# Altium schematic sheet GPS POWER.SchDoc
size A4
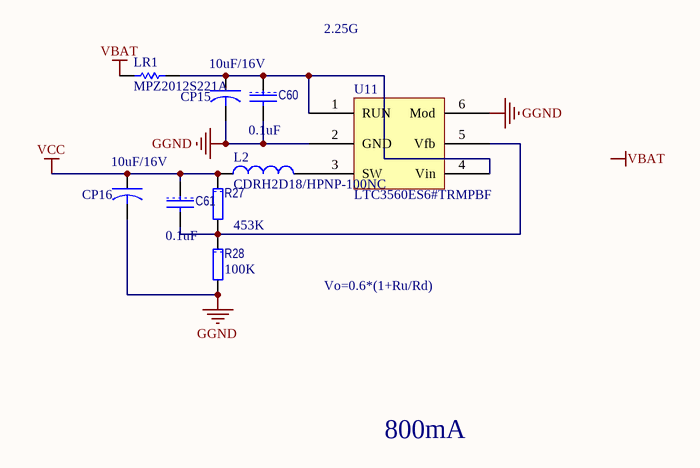
[diagram p0: GPS POWER.SchDoc]

## Parts
C60  value 0.1uF  [1608[0603]C]  (hidden comment: C1608X7R1H104K)
C61  value 0.1uF  [1608[0603]C]  (hidden comment: C1608X7R1H104K)
CP15  value 10uF/16V  [3216[1206]CB]  (hidden comment: TAJA106K016RNJ)
CP16  value 10uF/16V  [3216[1206]CB]  (hidden comment: TAJA106K016RNJ)
L2  CDRH2D18/HPNP-100NC  [INDP3232]
LR1  MPZ2012S221A  [2012[0805]]
R27  value 453K  [1608[0603]R]  (hidden comment: TNPW0603453KBEEN)
R28  value 100K  [1608[0603]R]  (hidden comment: CRCW0603100KFKEA)
U11  LTC3560ES6#TRMPBF  [SOT26A-6N]

## Nets
GGND: C60.2 CP15.2 CP16.2 R28.2 U11.2(GND) U11.6(Mod)
VBAT: LR1.2
VCC: C61.1 CP16.1 L2.1 R27.1
NetC60_1: C60.1 CP15.1 LR1.1 U11.1(RUN) U11.4(Vin)
NetC61_2: C61.2 R27.2 R28.1 U11.5(Vfb)
NetL2_2: L2.2 U11.3(SW)

## Notes on the sheet
- 2.25G
- Vo=0.6*(1+Ru/Rd)
- 800mA
- Labels drawn without touching a wire or pin: VBAT

## Library data of the parts
C60 C61 = CAP: 多层陶瓷电容器MLCC - SMD/SMT 0603 0.1uF 50volts X7R 10%; Manufacturer: TDK; 产品: General Type MLCCs; 产品种类: Low & Medium Capacitance SMD Ceramic Chip Capacitors; 外壳代码 - in: 0603; 外壳代码 - mm: 1608; 封装 / 箱体: 0603 (1608 metric); 封装: Reel; 尺寸: 0.8 mm W x 1.6 mm L x 0.8 mm H; 工作温度范围: - 55 C to + 125 C; 标准包装数量: 4000; 电压额定值: 50 V; 电容-nF: 100 nF; 电容-pF: 100000 pF; 系列: C; Category: 多层陶瓷电容器MLCC - SMD/SMT; ComponentLink1Description: http://www.tdk.com/pdf/general_B11.pdf; ComponentLink1URL: http://www.tdk.com/pdf/general_B11.pdf; Description 1: 多层陶瓷电容器MLCC - SMD/SMT 0603 0.1uF 50volts X7R 10%; Manufacturer Part Number: C1608X7R1H104K; Minimum Order Quantity: 1; Pricing 1: 1=0.160, 50=0.070, 100=0.036, 500=0.019, 1000=0.013, 4000=0.010, 8000=0.009, 12000=0.008, 20000=0.007 (USD); Reeling: True; RoHS - 贸泽: Y; RoHS: RoHS Compliant; Stock 1: 224604; Supplier 1: Mouser; Supplier Part Number 1: 810-C1608X7R1H104K; 制造商: TDK; 容差: 10 %; 温度系数/代码: X7R; 电容: 0.1 uF; 端接类型: SMD/SMT
CP15 CP16 = CAPACITOR: 钽质电容器-固体SMD 16volts 10uF 10%; Manufacturer: AVX; ESR: 3 Ohms; 产品: Tantalum Solid Standard Grade - Other Various; 产品种类: SMD Tantalum Capacitors; 制造商库存号: A Case; 外壳代码 - in: 1206; 外壳代码 - mm: 3216; 封装 / 箱体: 1206 (3216 metric); 封装: Reel; 尺寸: 1.6 mm W x 3.2 mm L; 工作温度范围: - 55 C to + 125 C; 损耗因数 DF: 8; 标准包装数量: 2000; 漏泄电流: 1.6 uA; 电压额定值: 16 V; 端接类型: SMD/SMT; 系列: TAJ; 高度: 1.8 mm; Category: 钽质电容器-固体SMD; ComponentLink1Description: http://www.avx.com/docs/Catalogs/taj.pdf; ComponentLink1URL: http://www.avx.com/docs/Catalogs/taj.pdf; Description 1: 钽质电容器-固体SMD 16volts 10uF 10%; Manufacturer Part Number: TAJA106K016RNJ; Minimum Order Quantity: 1; Pricing 1: 1=0.600, 100=0.280, 200=0.250, 500=0.221, 1000=0.200, 2000=0.140, 5000=0.131, 10000=0.124, 25000=0.103 (USD); Reeling: True; RoHS - 贸泽: Y; RoHS: RoHS Compliant; Stock 1: 20335; Supplier 1: Mouser; Supplier Part Number 1: 581-TAJA106K016R; 制造商: AVX; 容差: 10 %; 电容: 10 uF
L2 = Inductor: 固定电感器 10uH 430mA; Manufacturer: Sumida; 尺寸: 3.2 mm W x 3.2 mm L x 2 mm H; 最大直流电流: 0.85 A; 最大直流电阻: 245 mOhms; 封装: Reel; 产品: SMD Power Inductor; 系列: CDRH; 屏蔽: Shielded; 端接类型: SMD/SMT; 容差: 30 %; 外壳高度: 2 mm; 外壳长度: 3.2 mm; 产品种类: SMD Power Inductors Shielded; 标准包装数量: 1000; 测试频率: 100 kHz; Supplier 1: Mouser; Supplier Part Number 1: 851-CDRH2D18HP-100NC; Manufacturer Part Number: CDRH2D18/HPNP-100NC; RoHS: RoHS Compliant; Description 1: 固定电感器 10uH 430mA; Category: 固定电感器; Stock 1: 1271; Pricing 1: 1=0.810, 10=0.650, 100=0.590, 500=0.540, 1000=0.490, 5000=0.450, 10000=0.410, 25000=0.370 (USD); 电感: 10 uH; 外壳宽度: 3.2 mm; 制造商: Sumida; RoHS - 贸泽: Y; Minimum Order Quantity: 1; Reeling: True; ComponentLink1URL: http://www.mouser.com/ds/2/390/cdrh2d18hp-189473.pdf; ComponentLink1Description: http://www.mouser.com/ds/2/390/cdrh2d18hp-189473.pdf; Value: 10uH
LR1 = Res Semi: 电磁干扰滤波珠子、扼流圈和阵列 Ferrite Chip Beads; Manufacturer: TDK; 阻抗: 220 Ohms; 最大直流电流: 3 A; 最大直流电阻: 0.04 Ohms; 工作温度范围: - 55 C to + 125 C; 封装 / 箱体: 2012; 封装: Reel; 端接类型: SMD/SMT; 容差: 25 %; 产品种类: Ferrite Beads; 标准包装数量: 4000; Supplier 1: Mouser; Supplier Part Number 1: 810-MPZ2012S221A; Manufacturer Part Number: MPZ2012S221A; RoHS: RoHS Compliant; Description 1: 电磁干扰滤波珠子、扼流圈和阵列 Ferrite Chip Beads; Category: 电磁干扰滤波珠子、扼流圈和阵列; Stock 1: 26540; Pricing 1: 1=0.070, 50=0.060, 100=0.053, 500=0.040, 1000=0.035, 4000=0.031, 8000=0.029, 12000=0.025 (USD); 制造商: TDK; RoHS - 贸泽: Y; Minimum Order Quantity: 1; Reeling: True; ComponentLink1URL: http://www.mouser.com/ds/2/400/e9413_mpz-24582.pdf; ComponentLink1Description: http://www.mouser.com/ds/2/400/e9413_mpz-24582.pdf
R27 = RES: 薄膜电阻器 - SMD 453Kohms .1% 25ppm; Manufacturer: Vishay; Manufacturer Part Number: TNPW0805453KBEEN; 尺寸: 1.25 mm W x 2 mm L x 0.45 mm H; 工作温度范围: - 55 C to + 155 C; 封装 / 箱体: 0805 (2012 metric); 封装: Reel; 功率额定值: 125 mW (1/8 W); 产品: Precision Resistors Thin Film SMD; 系列: TNPW; 温度系数: 25 PPM / K; 端接类型: SMD/SMT; 容差: 0.1 %; 电压额定值: 150 V; 外壳高度: 0.45 mm; 外壳长度: 2 mm; 外壳宽度: 1.25 mm; 产品种类: 0805 Precision Thin Film Chip Resistors; 标准包装数量: 1000; Supplier 1: Mouser; Supplier Part Number 1: 71-TNPW0805453KBEEN; RoHS: RoHS Compliant; Description 1: 薄膜电阻器 - SMD 453Kohms .1% 25ppm; Category: 薄膜电阻器 - SMD; Stock 1: 0; Pricing 1: 1=0.940, 50=0.800, 100=0.650, 500=0.580, 1000=0.522, 2000=0.464, 4000=0.455, 6000=0.450, 8000=0.440 (USD); 电阻: 453 kOhms; 制造商: Vishay; RoHS - 贸泽: E; Minimum Order Quantity: 1; Reeling: True; ComponentLink1URL: http://www.vishay.com/doc?28758; ComponentLink1Description: http://www.vishay.com/doc?28758
R28 = RES: 厚膜电阻器 - SMD 1/10watt 100Kohms 1%; Manufacturer: Vishay / Dale; 尺寸: 0.85 mm W x 1.55 mm L x 0.45 mm H; 工作温度范围: - 55 C to + 155 C; 封装 / 箱体: 0603 (1608 metric); 封装: Reel; 功率额定值: 100 mW; 产品: Thick Film Resistors SMD; 系列: CRCW; 温度系数: 100 PPM / K; 端接类型: SMD/SMT; 电压额定值: 75 V; 制造商: Vishay; 产品种类: 0603 Thick Film Chip Resistors; 标准包装数量: 5000; 外壳代码 - in: 0603; 外壳代码 - mm: 1608; Supplier 1: Mouser; Supplier Part Number 1: 71-CRCW0603-100K-E3; Manufacturer Part Number: CRCW0603100KFKEA; RoHS: RoHS Compliant By Exemption; Category: 厚膜电阻器 - SMD; Stock 1: 175756; Pricing 1: 1=0.080, 10=0.013, 100=0.010, 1000=0.008, 5000=0.005, 25000=0.004, 50000=0.003 (USD); 电阻: 100 kOhms; 容差: 1 %; RoHS - 贸泽: E; Minimum Order Quantity: 1; Reeling: True; ComponentLink1URL: http://www.mouser.com/ds/2/427/dcrcwe3-109170.pdf; ComponentLink1Description: http://www.mouser.com/ds/2/427/dcrcwe3-109170.pdf; Description 1: 厚膜电阻器 - SMD 1/10watt 100Kohms 1%
U11 = LTC3405A: IC REG BUCK SYNC ADJ TSOT23-6; Manufacturer: Linear Technology; Output Type: Adjustable; Number of Outputs: 1; Voltage - Output: 0.6 V ~ 5.5 V; Voltage - Input: 2.5 V ~ 5.5 V; PWM Type: Current Mode, Burst Mode?; Frequency - Switching: 2.25MHz; Current - Output: 800mA; Synchronous Rectifier: Yes; Supplier 1: Digi-Key; Supplier Part Number 1: LTC3560ES6#TRMPBFCT-ND; Manufacturer Part Number: LTC3560ES6#TRMPBF; RoHS: RoHS Compliant; Description 1: IC REG BUCK SYNC ADJ TSOT23-6; Category: Integrated Circuits (ICs); Stock 1: 2081; Pricing 1: 1=4.39, 25=3.9196, 100=3.5276 (USD); Packaging: Cut Tape (CT); Type: Step-Down (Buck); Operating Temperature: -40°C ~ 85°C; Mounting Type: Surface Mount; Package / Case: SOT-23-6 Thin, TSOT-23-6; Supplier Device Package: TSOT-23-6; ComponentLink1URL: http://www.linear.com/docs/18318; ComponentLink1Description: http://www.linear.com/docs/18318